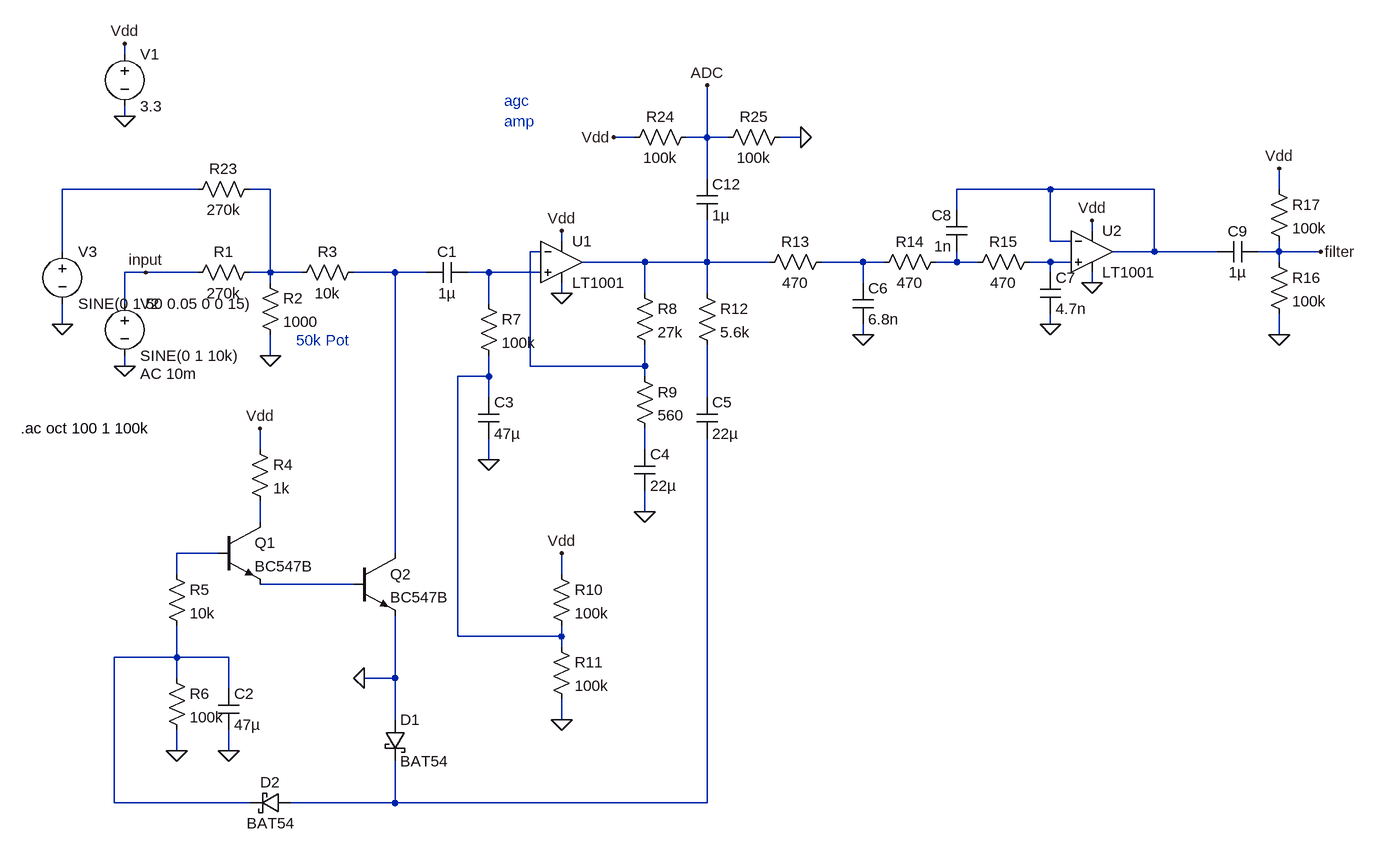
[diagram p0: schematic 2. audio input.asc]
2. audio input.asc, the LTspice schematic file:
Version 4
SHEET 1 956 932
WIRE -2224 -304 -2224 -320
WIRE -2224 -208 -2224 -224
WIRE -1440 -176 -1472 -176
WIRE -1328 -176 -1328 -256
WIRE -1328 -176 -1360 -176
WIRE -1296 -176 -1328 -176
WIRE -1184 -176 -1216 -176
WIRE -1328 -112 -1328 -176
WIRE -2112 -96 -2320 -96
WIRE -2000 -96 -2032 -96
WIRE -800 -96 -944 -96
WIRE -640 -96 -800 -96
WIRE -448 -96 -448 -128
WIRE -944 -64 -944 -96
WIRE -736 -32 -736 -48
WIRE -1552 -16 -1552 -32
WIRE -800 -16 -800 -96
WIRE -768 -16 -800 -16
WIRE -2320 0 -2320 -96
WIRE -1584 0 -1600 0
WIRE -640 0 -640 -96
WIRE -640 0 -704 0
WIRE -544 0 -640 0
WIRE -448 0 -448 -16
WIRE -448 0 -480 0
WIRE -384 0 -448 0
WIRE -1424 16 -1520 16
WIRE -1328 16 -1328 -48
WIRE -1328 16 -1424 16
WIRE -1232 16 -1328 16
WIRE -1088 16 -1152 16
WIRE -1056 16 -1088 16
WIRE -944 16 -944 0
WIRE -944 16 -976 16
WIRE -912 16 -944 16
WIRE -800 16 -832 16
WIRE -768 16 -800 16
WIRE -448 16 -448 0
WIRE -2192 32 -2224 32
WIRE -2112 32 -2192 32
WIRE -2000 32 -2000 -96
WIRE -2000 32 -2032 32
WIRE -1952 32 -2000 32
WIRE -1808 32 -1872 32
WIRE -1760 32 -1808 32
WIRE -1664 32 -1696 32
WIRE -1584 32 -1664 32
WIRE -800 32 -800 16
WIRE -2000 48 -2000 32
WIRE -1088 48 -1088 16
WIRE -736 48 -736 32
WIRE -1552 64 -1552 48
WIRE -1424 64 -1424 16
WIRE -1328 64 -1328 16
WIRE -2224 80 -2224 32
WIRE -1664 80 -1664 32
WIRE -2320 112 -2320 80
WIRE -800 112 -800 96
WIRE -1088 128 -1088 112
WIRE -448 128 -448 96
WIRE -2000 160 -2000 128
WIRE -2224 176 -2224 160
WIRE -1600 176 -1600 0
WIRE -1424 176 -1424 144
WIRE -1424 176 -1600 176
WIRE -1664 192 -1664 160
WIRE -1664 192 -1712 192
WIRE -1424 192 -1424 176
WIRE -1664 224 -1664 192
WIRE -1328 224 -1328 144
WIRE -2016 304 -2016 272
WIRE -1424 304 -1424 272
WIRE -1664 320 -1664 288
WIRE -1424 400 -1424 368
WIRE -2016 416 -2016 384
WIRE -2080 464 -2144 464
WIRE -1808 464 -1808 32
WIRE -2144 496 -2144 464
WIRE -1552 496 -1552 464
WIRE -1872 512 -2016 512
WIRE -1712 592 -1712 192
WIRE -1552 592 -1552 576
WIRE -1552 592 -1712 592
WIRE -1552 608 -1552 592
WIRE -2144 624 -2144 576
WIRE -2144 624 -2240 624
WIRE -2064 624 -2144 624
WIRE -2144 656 -2144 624
WIRE -1808 656 -1808 560
WIRE -1808 656 -1856 656
WIRE -2064 672 -2064 624
WIRE -1808 720 -1808 656
WIRE -1552 720 -1552 688
WIRE -2144 768 -2144 736
WIRE -2064 768 -2064 736
WIRE -2240 848 -2240 624
WIRE -2032 848 -2240 848
WIRE -1808 848 -1808 784
WIRE -1808 848 -1968 848
WIRE -1328 848 -1328 288
WIRE -1328 848 -1808 848
FLAG -2224 -208 0
FLAG -2224 -320 Vdd
FLAG -2224 176 0
FLAG -2192 32 input
FLAG -2000 160 0
FLAG -2016 272 Vdd
FLAG -2144 768 0
FLAG -2064 768 0
FLAG -1856 656 0
FLAG -1552 64 0
FLAG -1552 -32 Vdd
FLAG -1664 320 0
FLAG -1424 400 0
FLAG -1552 464 Vdd
FLAG -1552 720 0
FLAG -2320 112 0
FLAG -1328 -256 ADC
FLAG -1472 -176 Vdd
FLAG -1184 -176 0
FLAG -1088 128 0
FLAG -736 48 0
FLAG -800 112 0
FLAG -736 -48 Vdd
FLAG -448 -128 Vdd
FLAG -448 128 0
FLAG -384 0 filter
SYMBOL voltage -2224 -320 R0
WINDOW 123 0 0 Left 2
WINDOW 39 0 0 Left 2
SYMATTR InstName V1
SYMATTR Value 3.3
SYMBOL voltage -2224 64 R0
WINDOW 123 24 124 Left 2
WINDOW 39 0 0 Left 2
SYMATTR Value2 AC 10m
SYMATTR InstName V2
SYMATTR Value SINE(0 1 10k)
SYMBOL res -2016 16 R90
WINDOW 0 0 56 VBottom 2
WINDOW 3 32 56 VTop 2
SYMATTR InstName R1
SYMATTR Value 270k
SYMBOL res -2016 32 R0
SYMATTR InstName R2
SYMATTR Value 1000
SYMBOL res -1856 16 R90
WINDOW 0 0 56 VBottom 2
WINDOW 3 32 56 VTop 2
SYMATTR InstName R3
SYMATTR Value 10k
SYMBOL cap -1696 16 R90
WINDOW 0 0 32 VBottom 2
WINDOW 3 32 32 VTop 2
SYMATTR InstName C1
SYMATTR Value 1µ
SYMBOL res -2032 288 R0
SYMATTR InstName R4
SYMATTR Value 1k
SYMBOL npn -2080 416 R0
SYMATTR InstName Q1
SYMATTR Value BC547B
SYMBOL npn -1872 464 R0
SYMATTR InstName Q2
SYMATTR Value BC547B
SYMBOL res -2160 480 R0
SYMATTR InstName R5
SYMATTR Value 10k
SYMBOL res -2160 640 R0
SYMATTR InstName R6
SYMATTR Value 100k
SYMBOL cap -2080 672 R0
SYMATTR InstName C2
SYMATTR Value 47µ
SYMBOL schottky -1824 720 R0
SYMATTR InstName D1
SYMATTR Value BAT54
SYMATTR Description Diode
SYMATTR Type diode
SYMBOL schottky -1968 832 R90
WINDOW 0 0 32 VBottom 2
WINDOW 3 32 32 VTop 2
SYMATTR InstName D2
SYMATTR Value BAT54
SYMATTR Description Diode
SYMATTR Type diode
SYMBOL Opamps\\LT1001 -1552 -48 R0
SYMATTR InstName U1
SYMBOL res -1680 64 R0
SYMATTR InstName R7
SYMATTR Value 100k
SYMBOL cap -1680 224 R0
SYMATTR InstName C3
SYMATTR Value 47µ
SYMBOL res -1440 48 R0
SYMATTR InstName R8
SYMATTR Value 27k
SYMBOL res -1440 176 R0
SYMATTR InstName R9
SYMATTR Value 560
SYMBOL cap -1440 304 R0
SYMATTR InstName C4
SYMATTR Value 22µ
SYMBOL res -1568 480 R0
SYMATTR InstName R10
SYMATTR Value 100k
SYMBOL res -1568 592 R0
SYMATTR InstName R11
SYMATTR Value 100k
SYMBOL res -1344 48 R0
SYMATTR InstName R12
SYMATTR Value 5.6k
SYMBOL cap -1344 224 R0
SYMATTR InstName C5
SYMATTR Value 22µ
SYMBOL res -1136 0 R90
WINDOW 0 0 56 VBottom 2
WINDOW 3 32 56 VTop 2
SYMATTR InstName R13
SYMATTR Value 470
SYMBOL voltage -2320 -16 R0
WINDOW 123 0 0 Left 2
WINDOW 39 0 0 Left 2
SYMATTR InstName V3
SYMATTR Value SINE(0 1 50 0.05 0 0 15)
SYMBOL res -2016 -112 R90
WINDOW 0 0 56 VBottom 2
WINDOW 3 32 56 VTop 2
SYMATTR InstName R23
SYMATTR Value 270k
SYMBOL cap -1344 -112 R0
SYMATTR InstName C12
SYMATTR Value 1µ
SYMBOL res -1344 -192 R90
WINDOW 0 0 56 VBottom 2
WINDOW 3 32 56 VTop 2
SYMATTR InstName R24
SYMATTR Value 100k
SYMBOL res -1200 -192 R90
WINDOW 0 0 56 VBottom 2
WINDOW 3 32 56 VTop 2
SYMATTR InstName R25
SYMATTR Value 100k
SYMBOL res -960 0 R90
WINDOW 0 0 56 VBottom 2
WINDOW 3 32 56 VTop 2
SYMATTR InstName R14
SYMATTR Value 470
SYMBOL res -816 0 R90
WINDOW 0 0 56 VBottom 2
WINDOW 3 32 56 VTop 2
SYMATTR InstName R15
SYMATTR Value 470
SYMBOL cap -1104 48 R0
SYMATTR InstName C6
SYMATTR Value 6.8n
SYMBOL Opamps\\LT1001 -736 -64 R0
SYMATTR InstName U2
SYMBOL cap -816 32 R0
SYMATTR InstName C7
SYMATTR Value 4.7n
SYMBOL cap -928 -64 M0
SYMATTR InstName C8
SYMATTR Value 1n
SYMBOL cap -480 -16 R90
WINDOW 0 0 32 VBottom 2
WINDOW 3 32 32 VTop 2
SYMATTR InstName C9
SYMATTR Value 1µ
SYMBOL res -464 0 R0
SYMATTR InstName R16
SYMATTR Value 100k
SYMBOL res -464 -112 R0
SYMATTR InstName R17
SYMATTR Value 100k
TEXT -2384 272 Left 2 !.ac oct 100 1 100k
TEXT -1640 -232 Left 2 ;agc\namp
TEXT -1960 136 Left 2 ;50k Pot

The netlist it stands for:
* 2. audio input.asc
V1 Vdd 0 3.3
V2 input 0 SINE(0 1 10k) AC 10m
R1 N002 input 270k
R2 N002 0 1000
R3 N009 N002 10k
C1 N010 N009 1µ
R4 Vdd N014 1k
Q1 N014 N015 N016 0 BC547B
Q2 N009 N016 0 0 BC547B
R5 N015 N017 10k
R6 N017 0 100k
C2 N017 0 47µ
D1 0 N018 BAT54
D2 N018 N017 BAT54
XU1 N010 N004 Vdd 0 N005 LT1001  ; pins In+ In- V+ V- OUT
R7 N010 N011 100k
C3 N011 0 47µ
R8 N005 N004 27k
R9 N004 N013 560
C4 N013 0 22µ
R10 Vdd N011 100k
R11 N011 0 100k
R12 N005 N012 5.6k
C5 N012 N018 22µ
R13 N006 N005 470
V3 N001 0 SINE(0 1 50 0.05 0 0 15)
R23 N002 N001 270k
C12 ADC N005 1µ
R24 ADC Vdd 100k
R25 0 ADC 100k
R14 N007 N006 470
R15 N008 N007 470
C6 N006 0 6.8n
XU2 N008 N003 Vdd 0 N003 LT1001  ; pins In+ In- V+ V- OUT
C7 N008 0 4.7n
C8 N003 N007 1n
C9 filter N003 1µ
R16 filter 0 100k
R17 Vdd filter 100k
.model D D
.lib standard.dio
.model NPN NPN
.model PNP PNP
.lib standard.bjt
.ac oct 100 1 100k
* agc
* amp
* 50k Pot
.lib LTC.lib
.backanno
.end